# EAGLE design PinBuchse (EAGLE 7.5.0)
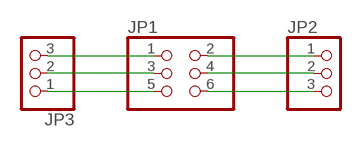
[diagram p0: schematic, sheet 1]

## Parts
JP1  PINHD-2X3  [2X03]
JP2  PINHD-1X3  [1X03]
JP3  PINHD-1X3  [1X03]

## Nets
N$1: JP1.1 JP3.3
N$2: JP1.3 JP3.2
N$3: JP1.5 JP3.1
N$4: JP1.2 JP2.1
N$5: JP1.4 JP2.2
N$6: JP1.6 JP2.3

## Library data of the parts
JP1 = pinhead:PINHD-2X3: PIN HEADER
JP2 JP3 = pinhead:PINHD-1X3: PIN HEADER

## Board
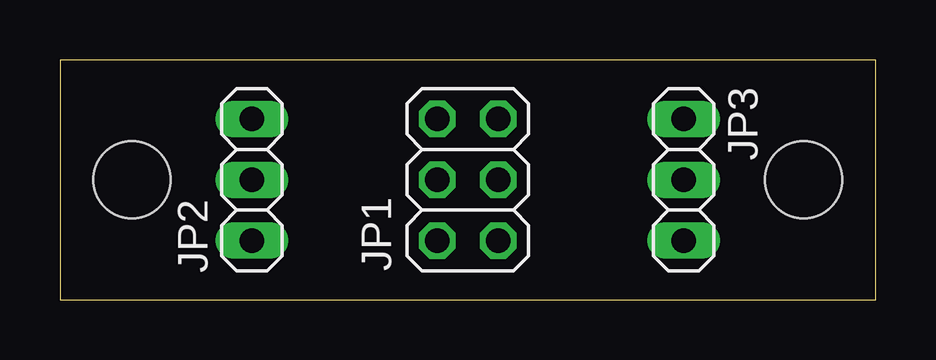
[diagram p1: board, top side]
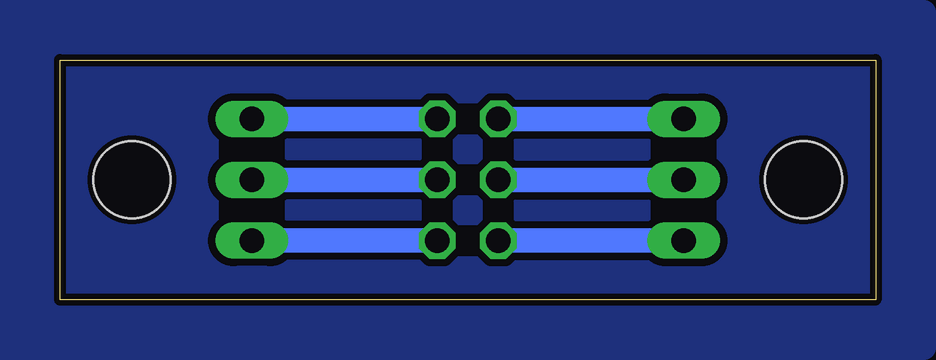
[diagram p2: board, bottom side, seen from below]

Size 34 x 10 mm. Coordinates in mm from the lower left corner, seen from the top.
Outline: 0,0 34,0 34,10 0,10 0,0
Copper layers (1*16): Top 0.035mm / dielectric 1.5mm / Bottom 0.035mm
Design rules "default *": minimum track width 10mil, minimum drill 24mil, track to track 12mil, track to pad 12mil, pad to pad 12mil, via to via 12mil, smd to smd 8mil, copper to edge 10mil, drill to drill 8mil, minimum pad ring 10mil, minimum via ring 8mil, stop-mask expansion 4mil, vias tented up to drill 0mil, thermal gap 10mil
Holes 3.2 mm at 3,5 31,5

### Footprints (pad centres in the part's own frame; a part is rotated, then mirrored left to right if it is on the bottom)
2X03 = drill 1.016 octagon: 1 -2.54,-1.27; 2 -2.54,1.27; 3 0,-1.27; 4 0,1.27; 5 2.54,-1.27; 6 2.54,1.27
1X03 = drill 1.016 long: 1 -2.54,0; 2 0,0; 3 2.54,0

### Placement (x,y rotation side)
JP1  17,5 90 top
JP2  8,5 90 top
JP3  26,5 270 top

### Tracks (layer width: path | path; a pad name or v marks a point on that pad's centre or on a via)
N$1
  Bottom 1.016: JP1.1 JP3.3
N$2
  Bottom 1.016: JP1.3 JP3.2
N$3
  Bottom 1.016: JP1.5 JP3.1
N$4
  Bottom 1.016: JP1.2 JP2.1
N$5
  Bottom 1.016: JP1.4 JP2.2
N$6
  Bottom 1.016: JP1.6 JP2.3
N$7
  pour Bottom: -2,12 37,12 37,-2 -2,-2